# Altium schematic sheet GAUGE_CLUSTER.SchDoc
size D; SheetNumber: 1; SheetTotal: 1
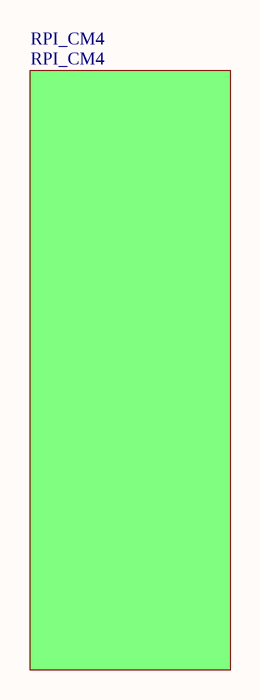
[diagram p0: GAUGE_CLUSTER.SchDoc]

## Sub-sheets
RPI_CM4 = RPI_CM4: no entries